# EAGLE design hk310 (EAGLE 9.6.1)
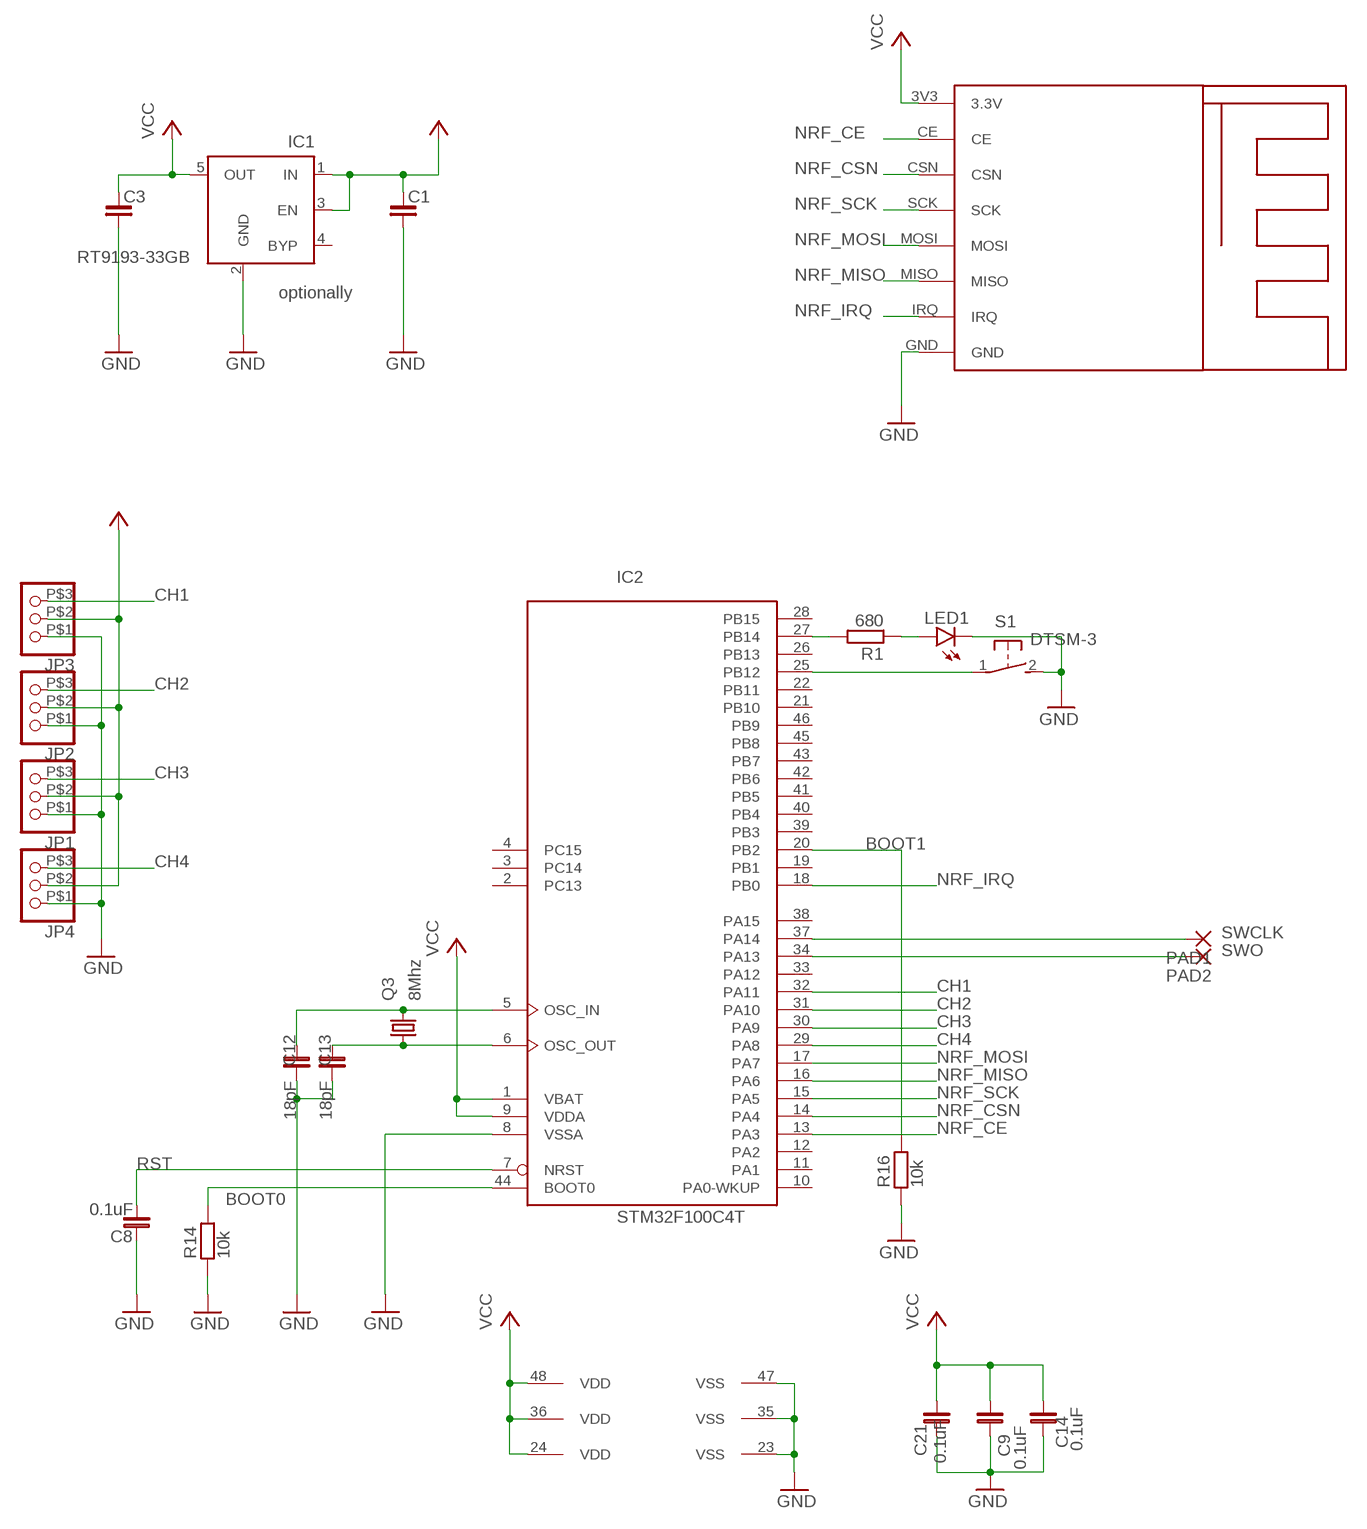
[diagram p0: schematic, sheet 1]

## Parts
C1  C_0805  [C0805]
C3  C_0805  [C0805]
C8  0.1uF  C_0603  [C0603]
C9  0.1uF  C_0603  [C0603]
C12  18pF  C_0603  [C0603]
C13  18pF  C_0603  [C0603]
C14  0.1uF  C_0603  [C0603]
C21  0.1uF  C_0603  [C0603]
IC1  RT9193-33GB  MIC5219XX  [SOT23-5]
IC2  STM32F100C4T  [LQFP48]
JP1  PINHD-1X3  [1X03]
JP2  PINHD-1X3  [1X03]
JP3  PINHD-1X3  [1X03]
JP4  PINHD-1X3  [1X03]
LED1  LED  [SMARTLED-TTW]
PAD1  SMD2  [SMD1,27-2,54]
PAD2  SMD2  [SMD1,27-2,54]
Q3  8Mhz  KX-12B  [6.0X3.5_2]
R1  680  R_0805  [R0805]
R14  10k  R_0805  [R0805]
R16  10k  R_0805  [R0805]
S1  DTSM-3  [DTSM-3]
U$1  NRF24MINI  [NRF24MINI]

## Nets
+5V: C1.1 IC1.1(IN) IC1.3(EN) JP1.P$2 JP2.P$2 JP3.P$2 JP4.P$2
BOOT0: IC2.44(BOOT0) R14.2
BOOT1: IC2.20(PB2) R16.2
CH1: IC2.32(PA11) JP3.P$3
CH2: IC2.31(PA10) JP2.P$3
CH3: IC2.30(PA9) JP1.P$3
CH4: IC2.29(PA8) JP4.P$3
GND: C1.2 C3.2 C8.1 C9.1 C12.1 C13.1 C14.1 C21.1 IC1.2(GND) IC2.8(VSSA) IC2.23(VSS) IC2.35(VSS) IC2.47(VSS) JP1.P$1 JP2.P$1 JP3.P$1 JP4.P$1 LED1.C@1(C) R14.1 R16.1 S1.2 U$1.GND
N$1: IC2.25(PB12) S1.1
N$3: IC2.27(PB14) R1.2
N$5: LED1.A@1(A) R1.1
NRF_CE: IC2.13(PA3) U$1.CE
NRF_CSN: IC2.14(PA4) U$1.CSN
NRF_IRQ: IC2.18(PB0) U$1.IRQ
NRF_MISO: IC2.16(PA6) U$1.MISO
NRF_MOSI: IC2.17(PA7) U$1.MOSI
NRF_SCK: IC2.15(PA5) U$1.SCK
OSC_IN_5: C12.2 IC2.5(OSC_IN) Q3.2
OSC_OUT_6: C13.2 IC2.6(OSC_OUT) Q3.1
RST: C8.2 IC2.7(NRST)
SWCLK: IC2.37(PA14) PAD1.1(P)
SWO: IC2.34(PA13) PAD2.1(P)
VCC: C3.1 C9.2 C14.2 C21.2 IC1.5(OUT) IC2.1(VBAT) IC2.9(VDDA) IC2.24(VDD) IC2.36(VDD) IC2.48(VDD) U$1.3V3(3.3V)
Unconnected: IC1.4(BYP) IC2.2(PC13) IC2.3(PC14) IC2.4(PC15) IC2.10(PA0-WKUP) IC2.11(PA1) IC2.12(PA2) IC2.19(PB1) IC2.21(PB10) IC2.22(PB11) IC2.26(PB13) IC2.28(PB15) IC2.33(PA12) IC2.38(PA15) IC2.39(PB3) IC2.40(PB4) IC2.41(PB5) IC2.42(PB6) IC2.43(PB7) IC2.45(PB8) IC2.46(PB9)

## Notes on the sheet
- optionally

## Library data of the parts
C1 C3 C8 C9 C12-C14 C21 = skydrop:C_: NON-POLARIZED CAP
IC1 = skydrop:MIC5219XX: VOLTAGE REGULATOR; OC_FARNELL: unknown; OC_NEWARK: unknown
IC2 = micro-stm_v3:STM32F100C*T: ARM 32-bit Cortex™-M3 CPU 24 MHz maximum frequency 16 to 128 Kbytes of Flash memory 4 to 8 kbytes of SRAM 37 GPIOs 2.0 to 3.6 V application supply
JP1-JP4 = skydrop:PINHD-1X3: PIN HEADER
LED1 = led:LED: LED OSRAM: - CHIPLED LG R971, LG N971, LY N971, LG Q971, LY Q971, LO R971, LY R971 LH N974, LH R974 LS Q976, LO Q976, LY Q976 LO Q996 - Hyper CHIPLED LW Q18S LB Q993, LB Q99A, LB R99A - SideLED LS A670, LO A670, LY A670, LG A670, LP A670 LB A673, LV A673, LT A673, LW A673 LH A674 LY A675 LS A676, LA A676, LO A676, LY A676, LW A676 LS A679, LY A679, LG A679 - Hyper Micro SIDELED® LS Y876, LA Y876, LO Y876, LY Y876 LT Y87S - SmartLED LW L88C, LW L88S LB L89C, LB L89S, LG L890 LS L89K, LO L89K, LY L89K LS L896, LA L896, LO L896, LY L896 - TOPLED LS T670, LO T670, LY T670, LG T670, LP T670 LSG T670, LSP T670, LSY T670, LOP T670, LYG T670 LG T671, LOG T671, LSG T671 LB T673, LV T673, LT T673, LW T673 LH T674 LS T676, LA T676, LO T676, LY T676, LB T676, LH T676, LSB T676, LW T676 LB T67C, LV T67C, LT T67C, LS T67K, LO T67K, LY T67K, LW E67C LS E67B, LA E67B, LO E67B, LY E67B, LB E67C, LV E67C, LT E67C LW T67C LS T679, LY T679, LG T679 LS T770, LO T770, LY T770, LG T770, LP T770 LB T773, LV T773, LT T773, LW T773 LH T774 LS E675, LA E675, LY E675, LS T675 LS T776, LA T776, LO T776, LY T776, LB T776 LHGB T686 LT T68C, LB T68C - Hyper Mini TOPLED® LB M676 - Mini TOPLED Santana® LG M470 LS M47K, LO M47K, LY M47K Source: http://www.osram.convergy.de LUXEON: - LUMILED® LXK2-PW12-R00, LXK2-PW12-S00, LXK2-PW14-U00, LXK2-PW14-V00 LXK2-PM12-R00, LXK2-PM12-S00, LXK2-PM14-U00 LXK2-PE12-Q00, LXK2-PE12-R00, LXK2-PE12-S00, LXK2-PE14-T00, LXK2-PE14-U00 LXK2-PB12-K00, LXK2-PB12-L00, LXK2-PB12-M00, LXK2-PB14-N00, LXK2-PB14-P00, LXK2-PB14-Q00 LXK2-PR12-L00, LXK2-PR12-M00, LXK2-PR14-Q00, LXK2-PR14-R00 LXK2-PD12-Q00, LXK2-PD12-R00, LXK2-PD12-S00 LXK2-PH12-R00, LXK2-PH12-S00 LXK2-PL12-P00, LXK2-PL12-Q00, LXK2-PL12-R00 Source: www.luxeon.com KINGBRIGHT: KA-3528ASYC Source: www.kingbright.com
PAD1 PAD2 = wirepad:SMD2: SMD PAD
Q3 = crystal-geyer_V1_0:KX: Quartz Crystals (MHz) SMD: KX - Serie Model Size l/w/h [mm] Frequency Range Frequency Stability Temp. Range [°C] Load Capacitance AECQ 200 availabel Datasheet KX-4 KX-5 KX-6 KX-7 KX-9A KX-9B KX-12A KX-12B KX-13 KX-20 KX-K KX-KS 1.6/1.2/0.3 2.0/1.6/0.45 2.5/2.0/0.55 3.2/2.5/0.8 5.0/3.2/1.0 5.0/3.2/1.1 6.0/3.5/1.1 6.0/3.5/1.0 7.0/5.0 /1.3 11.6/5.5/1.6 12.3/4.5/4.2 12.3/4.5/3.2 24.0 ~ 80.0 MHz 16.0 ~ 80.0 MHz 12.0 ~ 80.0 MHz 8.0 ~ 60.0 MHz 7,68 ~ 300,0 MHz 8,0 ~ 50,0 MHz 8,0 ~ 150,0 MHz 8,0 ~ 50,0 MHz 6,0 ~ 160,0 MHz 3,579 ~ 25,0 MHz 3,579 ~ 70,0 MHz 3,579 ~ 70,0 MHz ±10 … ±50ppm ±10 … ±50ppm ±10 … ±50ppm ±10 … ±50ppm ±10 … ±50ppm ±10 … ±50ppm ±10 … ±50ppm ±10 … ±50ppm ±10 … ±50ppm ±50ppm ±10 … ±50ppm ±10 … ±50ppm (*) -40°C …+85°C (*) -40°C …+125°C (*) -40°C …+125°C (*) -40°C …+125°C (*) -40°C …+105°C (*) -40°C …+105°C (*) -40°C …+125°C (*) -40°C …+105°C (*) -40°C …+105°C (*) -40°C …+105°C (*) -40°C …+85°C (*) -40°C …+85°C 8, 8…16 8, 8…16 10, 8…16 12, 7…20 16, 10…20 16, 10…20 16, 10…20 16, 12…20 16, 12…20 16, 12…20 16, 12…30 16, 12…30 - yes yes yes - - - - - - - - KX-4.pdf <http://www.geyer-electronic.de/uploads/tx_userartikelfrequenz/GEYER-KX-4.pdf> KX-5.pdf <http://www.geyer-electronic.de/uploads/tx_userartikelfrequenz/GEYER-KX-5.pdf> KX-6.pdf <http://www.geyer-electronic.de/uploads/tx_userartikelfrequenz/GEYER-KX-6.pdf> KX-7.pdf <http://www.geyer-electronic.de/uploads/tx_userartikelfrequenz/GEYER-KX-7.pdf> KX-9A.pdf <http://www.geyer-electronic.de/uploads/tx_userartikelfrequenz/GEYER-KX-9A.pdf> KX-9B.pdf <http://www.geyer-electronic.de/uploads/tx_userartikelfrequenz/GEYER-KX-9B.pdf> KX-12A.pdf <http://www.geyer-electronic.de/uploads/tx_userartikelfrequenz/GEYER-KX-12A.pdf> KX-12B.pdf <http://www.geyer-electronic.de/uploads/tx_userartikelfrequenz/GEYER-KX-12B.pdf> KX-13.pdf <http://www.geyer-electronic.de/uploads/tx_userartikelfrequenz/GEYER-KX-13.pdf> KX-20.pdf <http://www.geyer-electronic.de/uploads/tx_userartikelfrequenz/GEYER-KX-20.pdf> KX-K.pdf <http://www.geyer-electronic.de/uploads/tx_userartikelfrequenz/GEYER-KX-K.pdf> KX-KS.pdf <http://www.geyer-electronic.de/uploads/tx_userartikelfrequenz/GEYER-KX-KS.pdf> <http://www.geyer-electronic.de/fileadmin/template/img/logo-geyer-electronic.png> Details see: http://www.geyer-electronic.de/Frequenz-Produkte.9.0.html Created 2016-06-07, Hans Locher 2016 (C) Geyer Quartz Technology KX4,KX5,KX6,KX7,KX9A,KX9B,KX12A,KX12B,KX13,KX20,KXK,KXKS;1612;2016;2520;3225;5032;6035;7050;11655;12345;1,6x1,2;2,0x1,6;2,5x2,0;3,2x2,5;5,0x3,2;6,0x3,5;7,0x5,0;11,6x5,5;12,3x4,5;12,3x4,5;1.6x1.2;2.0x1.6;2.5x2.0;3.2x2.5;5.0x3.2;6.0x3.5;7.0x5.0;11.6x5.5;12.3x4.5;12.3x4.5;
R1 R14 R16 = skydrop:R_: RESISTOR
S1 = switch-tact:DTSM-3
U$1 = nrf24mini:NRF24MINI

## Net classes
1 vcc: width 0.3 mm

## Board
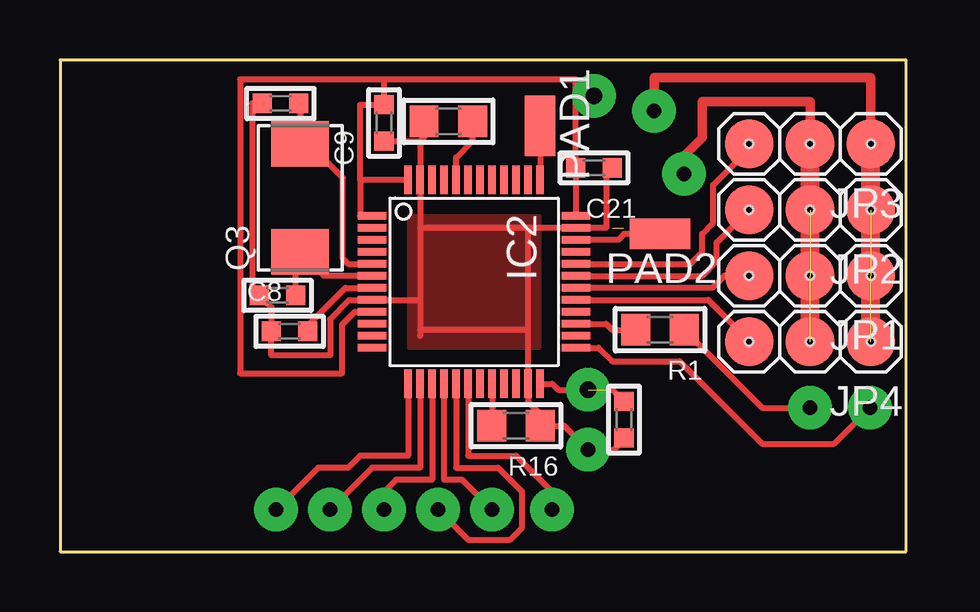
[diagram p1: board, top side]
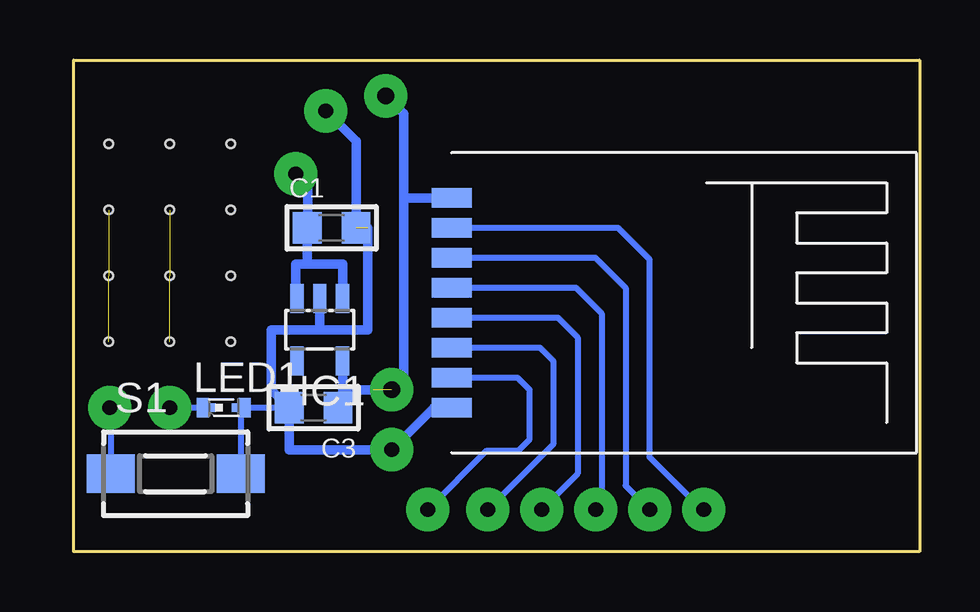
[diagram p2: board, bottom side, seen from below]

Size 35.25 x 20.5 mm. Coordinates in mm from the lower left corner, seen from the top.
Outline: 0,0 35.25,0 35.25,20.5 0,20.5 0,0
Copper layers (1*16): Top 0.035mm / dielectric 1.5mm / Bottom 0.035mm
Design rules "default *": minimum track width 10mil, minimum drill 24mil, track to track 0.2mm, track to pad 0.2mm, pad to pad 0.2mm, via to via 8mil, smd to smd 0.01mm, copper to edge 0mil, drill to drill 0.7mm, minimum pad ring 10mil, minimum via ring 8mil, stop-mask expansion 4mil, vias tented up to drill 0mil, thermal gap 10mil

### Footprints (pad centres in the part's own frame; a part is rotated, then mirrored left to right if it is on the bottom)
C0805 = smd 1.2 x 1.3: 1 -1.016,0; 2 1.016,0
C0603 = smd 0.8 x 0.8: 1 -0.762,0; 2 0.762,0
SOT23-5 = smd 0.55 x 1.2: 1 -0.95,-1.3; 2 0,-1.3; 3 0.95,-1.3; 4 0.95,1.3; 5 -0.95,1.3
LQFP48 = smd 0.3 x 1.2: 1 -2.75,-4.25; 2 -2.25,-4.25; 3 -1.75,-4.25; 4 -1.25,-4.25; 5 -0.75,-4.25; 6 -0.25,-4.25; 7 0.25,-4.25; 8 0.75,-4.25; 9 1.25,-4.25; 10 1.75,-4.25; 11 2.25,-4.25; 12 2.75,-4.25; 25 2.75,4.25; 26 2.25,4.25; 27 1.75,4.25; 28 1.25,4.25; 29 0.75,4.25; 30 0.25,4.25; 31 -0.25,4.25; 32 -0.75,4.25; 33 -1.25,4.25; 34 -1.75,4.25; 35 -2.25,4.25; 36 -2.75,4.25 | smd 1.2 x 0.3: 13 4.25,-2.75; 14 4.25,-2.25; 15 4.25,-1.75; 16 4.25,-1.25; 17 4.25,-0.75; 18 4.25,-0.25; 19 4.25,0.25; 20 4.25,0.75; 21 4.25,1.25; 22 4.25,1.75; 23 4.25,2.25; 24 4.25,2.75; 37 -4.25,2.75; 38 -4.25,2.25; 39 -4.25,1.75; 40 -4.25,1.25; 41 -4.25,0.75; 42 -4.25,0.25; 43 -4.25,-0.25; 44 -4.25,-0.75; 45 -4.25,-1.25; 46 -4.25,-1.75; 47 -4.25,-2.25; 48 -4.25,-2.75
1X03 = smd 2.032 x 2.032: P$1 -2.54,0; P$2 0,0; P$3 2.54,0 | hole 0.35: -2.54,0; 0,0; 2.54,0
SMARTLED-TTW = smd 0.8 x 0.5: A 0,-0.875; C 0,0.875 | smd 0.35 x 0.35: A@1 0,-0.5; C@1 0,0.5
SMD1,27-2,54 = smd 1.27 x 2.54: 1 0,0
6.0X3.5_2 = smd 1.9 x 2.4: 1 -2.25,0; 2 2.25,0
R0805 = smd 1.2 x 1.3: 1 -1.016,0; 2 1.016,0
DTSM-3 = smd 2 x 1.6: 1 -2.7,0; 2 2.7,0
NRF24MINI = smd 1.676 x 0.813: 3V3 0,8.75; CE 0,7.5; CSN 0,6.25; GND 0,0; IRQ 0,1.25; MISO 0,2.5; MOSI 0,3.75; SCK 0,5

### Placement (x,y rotation side)
C1  24.5,13.5 0 bottom
C3  25.25,6 180 bottom
C8  9.56,9.19 0 top
C9  13.5,17.87 90 top
C12  9.19,18.69 0 top
C13  9.06,10.69 0 top
C14  23.5,5.5 90 top
C21  22.25,16 180 top
IC1  25,9.25 180 bottom
IC2  17.25,11.25 270 top
JP1  31.25,11.5 180 top
JP2  31.25,14.25 180 top
JP3  31.25,17 180 top
JP4  31.25,8.75 180 top
LED1  29,6 270 bottom
PAD1  20,17.75 180 top
PAD2  25,13.25 90 top
Q3  10,14.75 90 top
R1  25,9.25 180 top
R14  16.19,17.94 0 top
R16  19,5.25 180 top
S1  31,3.25 0 bottom
U$1  19.5,6 0 bottom

### Tracks (layer width: path | path; a pad name or v marks a point on that pad's centre or on a via)
+5V  (via drill 0.61 pad 1.8)  (2 unrouted)
  Top 0.4: JP3.P$2 31.25,18.75 26.75,18.75 26.75,17.25 26,16.5 v26,15.75
  Top 0.8: JP4.P$2 JP3.P$2
  Bottom 0.254: 26,10.55 IC1.3 | 25.52,13 C1.1 25.5,13.52
  Bottom 0.4: IC1.1 24.05,12 25.52,12 | 25.52,12 26,12 26,10.55 | C1.1 25.52,12 | v26,15.75 25.5,15.25 25.5,13.52
BOOT0
  Top 0.254: 16.5,15.98 IC2.44 16.5,16.44 17.2,17.14 R14.2 17.2,17.69
BOOT1
  Top 0.254: IC2.20 18,5.27 R16.2
CH1
  Top 0.254: IC2.32 26.25,12 26.75,12.5 26.75,13.25 27.21,13.71 27.21,15.29 28.71,16.79 JP3.P$3
CH2
  Top 0.254: JP2.P$3 27.36,12.89 27.36,12.1 26.75,11.5 IC2.31
CH3
  Top 0.254: IC2.30 27.17,11 27.67,11.5 JP1.P$3
CH4
  Top 0.254: JP4.P$3 28.71,8.79 27,10.5 IC2.29
GND  (via drill 0.61 pad 1.8)  (3 unrouted)
  Top 0.254: 15,13.5 IC2.47 15,17.11 | 15,13.5 15,10.5 | 15,10.5 IC2.8 12.98,10.48 12.04,10.48 11.25,9.69 11.25,8.19 8.8,8.19 C8.1 8.8,10.19 C13.1 8,10.69 8,18.69 C12.1 | 19.5,13.5 IC2.35 22.75,13.5 22.75,15.73 22.89,15.88 22.89,15.87 C21.1 | 19.5,13.5 15,13.5 | 19.5,9.25 IC2.23 19.5,6.25 20.02,5.73 R16.1 | 19.5,9.25 19.5,13.5 | 15,10.5 15,9.25 | 19.5,9.25 15,9.25 | C14.1 23.52,4.71 23.06,4.25 v22,4.25 21,5.25 R16.1 | R16.1 20.27,5 | 15,9.25 15,9 | C9.1 14.34,17.11 14.35,17.11 15,17.11 | 15,17.11 15.17,17.27 R14.1
  Top 0.4: JP3.P$1 33.79,19.75 24.75,19.75 v24.75,18.37
  Top 0.8: JP4.P$1 JP3.P$1
  Bottom 0.254: 26.27,4.23 C3.2 28,6 | 28,6 LED1.C@1 | 28,6 28.3,5.7 S1.2
  Bottom 0.4: IC1.2 25,9.25 | 25,9.25 27.02,9.25 27.02,6.75 C3.2 26.27,4.25 v22,4.25 20.25,6 U$1.GND | 25,9.25 23,9.25 23,13.5 | C1.2 23.48,17.11 v24.75,18.37
  pour Top: 14.5,14 14.5,8.5 20,8.5 20,14
N$1  (via drill 0.61 pad 1.8)
  Top 0.254: v33.75,6 32.25,4.5 29.25,4.5 25.82,7.93 23.01,7.93 22.44,8.5 IC2.25
  Bottom 0.254: v33.75,6 33.7,5.95 S1.1
N$3
  Top 0.254: IC2.27 22.75,9.5 23,9.25 R1.2
N$5  (via drill 0.61 pad 1.8)
  Top 0.254: v31.25,6 29.25,6 26.02,9.23 R1.1
  Bottom 0.254: LED1.A@1 v31.25,6
NRF_CE  (via drill 0.61 pad 1.8)
  Top 0.254: v9,1.75 10.75,3.5 12,3.5 12.5,4 14.5,4 IC2.13
  Bottom 0.254: v9,1.75 9.06,1.75 11.25,3.94 11.25,12.19 12.56,13.5 U$1.CE
NRF_CSN  (via drill 0.61 pad 1.8)
  Top 0.254: v11.25,1.75 13,3.5 15,3.5 IC2.14
  Bottom 0.254: U$1.CSN 13.5,12.25 12.25,11 12.25,2.75 v11.25,1.75
NRF_IRQ  (via drill 0.61 pad 1.8)
  Top 0.254: v20.5,1.75 20.5,2.5 19,4 17,4 IC2.18
  Bottom 0.254: v20.5,1.75 18.03,4.22 16.78,4.22 16.75,4.19 16.25,4.69 16.25,6.75 16.75,7.25 U$1.IRQ
NRF_MISO  (via drill 0.61 pad 1.8)
  Top 0.254: v18,1.75 16.75,3 16,3 IC2.16
  Bottom 0.254: v18,1.75 15.25,4.5 15.25,7.94 15.81,8.5 U$1.MISO
NRF_MOSI  (via drill 0.61 pad 1.8)
  Top 0.254: 15.73,1.77 v15.75,1.75 17,0.5 18.75,0.5 19.25,1 19.25,2.5 18.25,3.5 16.5,3.5 IC2.17 16.52,6.98
  Bottom 0.254: v15.75,1.75 14.25,3.25 14.25,8.94 15.06,9.75 U$1.MOSI
NRF_SCK  (via drill 0.61 pad 1.8)
  Top 0.254: IC2.15 15.5,3 14,3 13.5,2.5 v13.5,1.75
  Bottom 0.254: v13.5,1.75 13.25,2 13.25,9.94 14.31,11 U$1.SCK
OSC_IN_5
  Top 0.254: IC2.5 12,12 11.78,12.22 11.78,15.59 10.08,17.29 | 10.08,17.31 10.08,17.29 | 10.08,17.29 10.03,17.11 10.03,17.03 Q3.2 10,18.63 C12.2
OSC_OUT_6
  Top 0.254: IC2.6 11,11.5 Q3.1 9.83,12.33 C13.2
RST
  Top 0.254: 12.98,10.98 IC2.7 11.89,11 10.33,9.44 C8.2
SWCLK
  Top 0.254: 19.98,15.52 IC2.37 PAD1.1 20,17.21
SWO
  Top 0.254: 21.52,13.02 IC2.34 23.25,13 23.5,13.25 PAD2.1
VCC  (via drill 0.7 pad 1.8)  (1 unrouted)
  Top 0.254: 21.5,15.73 C21.2 | IC2.24 20.5,7 20.75,6.75 22.77,6.75 | 12.5,15.5 IC2.48 | IC2.36 C21.2 | C21.2 21.49,18.94 | 21.49,18.94 21.49,19.67 21.5,19.69 13.52,19.69 | IC2.1 12.5,14 12.5,15.5 | v22,6.75 23.02,6.75 23.02,6.74 C14.2 | 13.52,19.69 13.5,19.66 C9.2 12.5,18.63 12.5,15.5 | IC2.9 12.29,10 11.75,9.46 11.75,7.44 7.5,7.44 7.5,19.69 13.52,19.69 | v22.25,19 22.19,18.94 21.49,18.94
  Bottom 0.254: 23.8,6 C3.1 | 24.05,6.75 24.05,6.25
  Bottom 0.4: v22.25,19 21.5,18.25 21.5,14.75 | 21.5,14.75 21.5,7.25 v22,6.75 24.05,6.75 | IC1.5 24.05,6.25 24.05,6 C3.1 | U$1.3V3 21.5,14.75